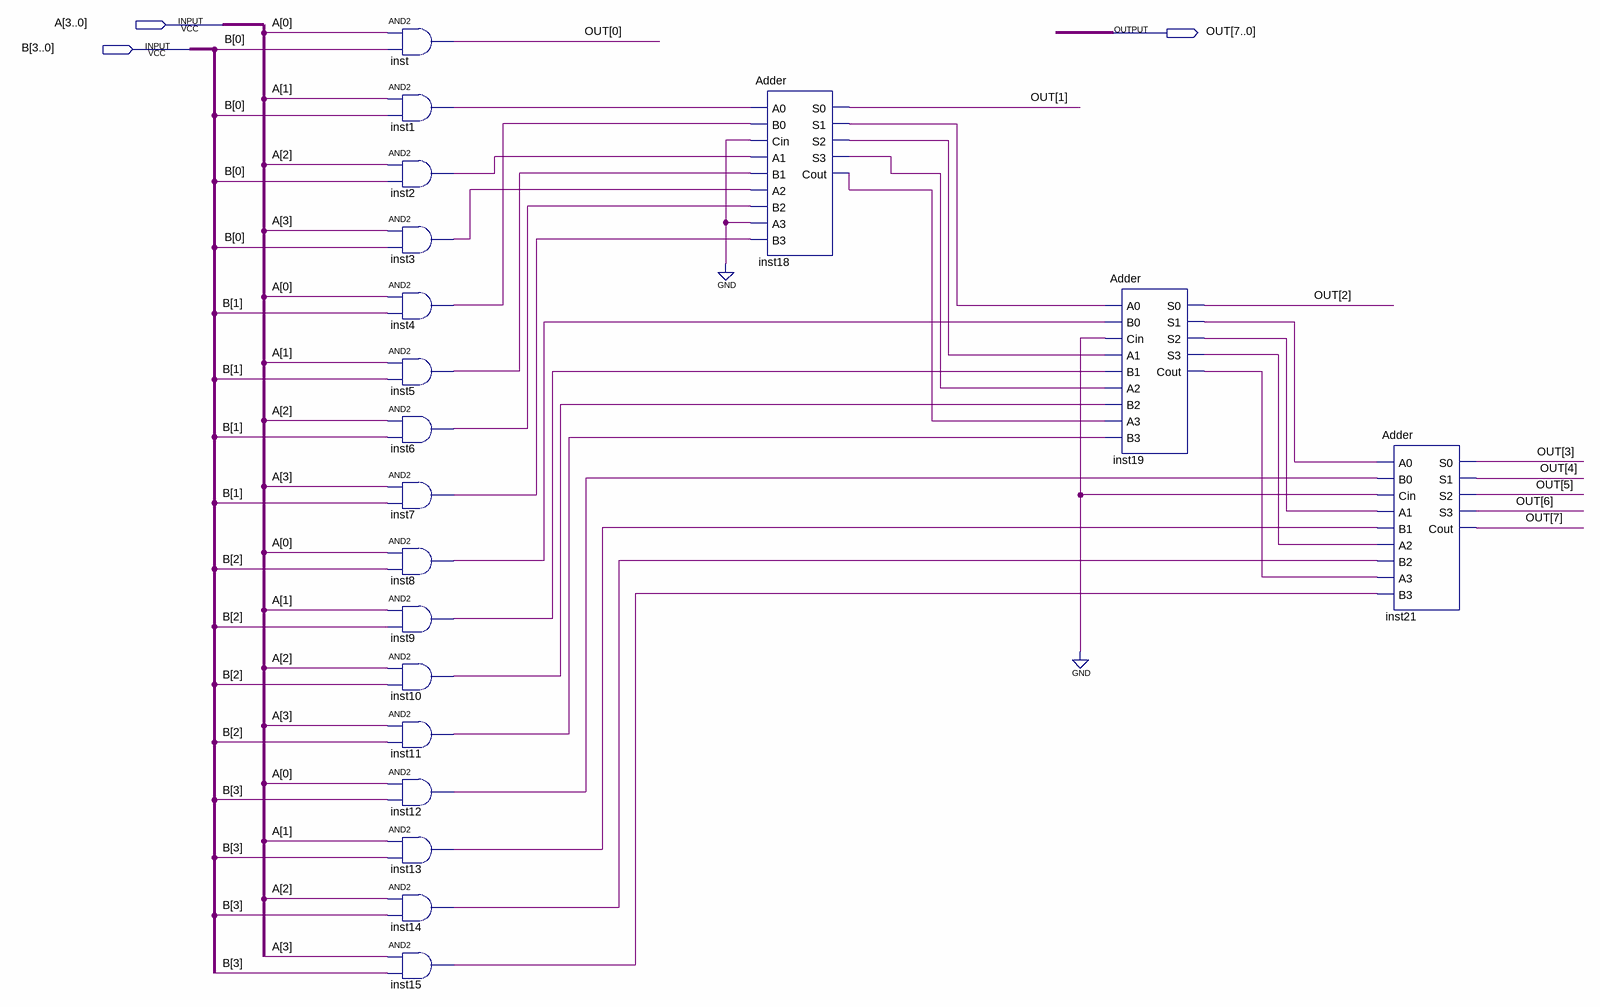
[diagram p0: schematic sheet]
// Quartus schematic LAB3_1.bdf as structural Verilog: 19 symbols, 3 pins
module LAB3_1 (
  input  [3:0] A,
  input  [3:0] B,
  output [7:0] OUT
);

  wire inst1_out, inst2_out, inst3_out, inst4_out, inst5_out, inst6_out, inst7_out, inst8_out, inst9_out,
       inst10_out, inst11_out, inst12_out, inst13_out, inst14_out, inst15_out, inst18_cout, inst18_s1,
       inst18_s2, inst18_s3, inst19_cout, inst19_s1, inst19_s2, inst19_s3;

  and inst (OUT[0], A[0], B[0]);
  and inst1 (inst1_out, A[1], B[0]);
  and inst2 (inst2_out, A[2], B[0]);
  and inst3 (inst3_out, A[3], B[0]);
  and inst4 (inst4_out, A[0], B[1]);
  and inst5 (inst5_out, A[1], B[1]);
  and inst6 (inst6_out, A[2], B[1]);
  and inst7 (inst7_out, A[3], B[1]);
  and inst8 (inst8_out, A[0], B[2]);
  and inst9 (inst9_out, A[1], B[2]);
  and inst10 (inst10_out, A[2], B[2]);
  and inst11 (inst11_out, A[3], B[2]);
  and inst12 (inst12_out, A[0], B[3]);
  and inst13 (inst13_out, A[1], B[3]);
  and inst14 (inst14_out, A[2], B[3]);
  and inst15 (inst15_out, A[3], B[3]);
  Adder inst18 (
    .A0(inst1_out), .B0(inst4_out), .Cin(1'b0), .A1(inst2_out), .B1(inst5_out), .A2(inst3_out),
    .B2(inst6_out), .A3(1'b0), .B3(inst7_out), .S0(OUT[1]), .S1(inst18_s1), .S2(inst18_s2), .S3(inst18_s3),
    .Cout(inst18_cout));
  Adder inst19 (
    .A0(inst18_s1), .B0(inst8_out), .Cin(1'b0), .A1(inst18_s2), .B1(inst9_out), .A2(inst18_s3),
    .B2(inst10_out), .A3(inst18_cout), .B3(inst11_out), .S0(OUT[2]), .S1(inst19_s1), .S2(inst19_s2),
    .S3(inst19_s3), .Cout(inst19_cout));
  Adder inst21 (
    .A0(inst19_s1), .B0(inst12_out), .Cin(1'b0), .A1(inst19_s2), .B1(inst13_out), .A2(inst19_s3),
    .B2(inst14_out), .A3(inst19_cout), .B3(inst15_out), .S0(OUT[3]), .S1(OUT[4]), .S2(OUT[5]), .S3(OUT[6]),
    .Cout(OUT[7]));
endmodule
